# Altium schematic sheet Integrated Connectors.SchDoc
size Letter
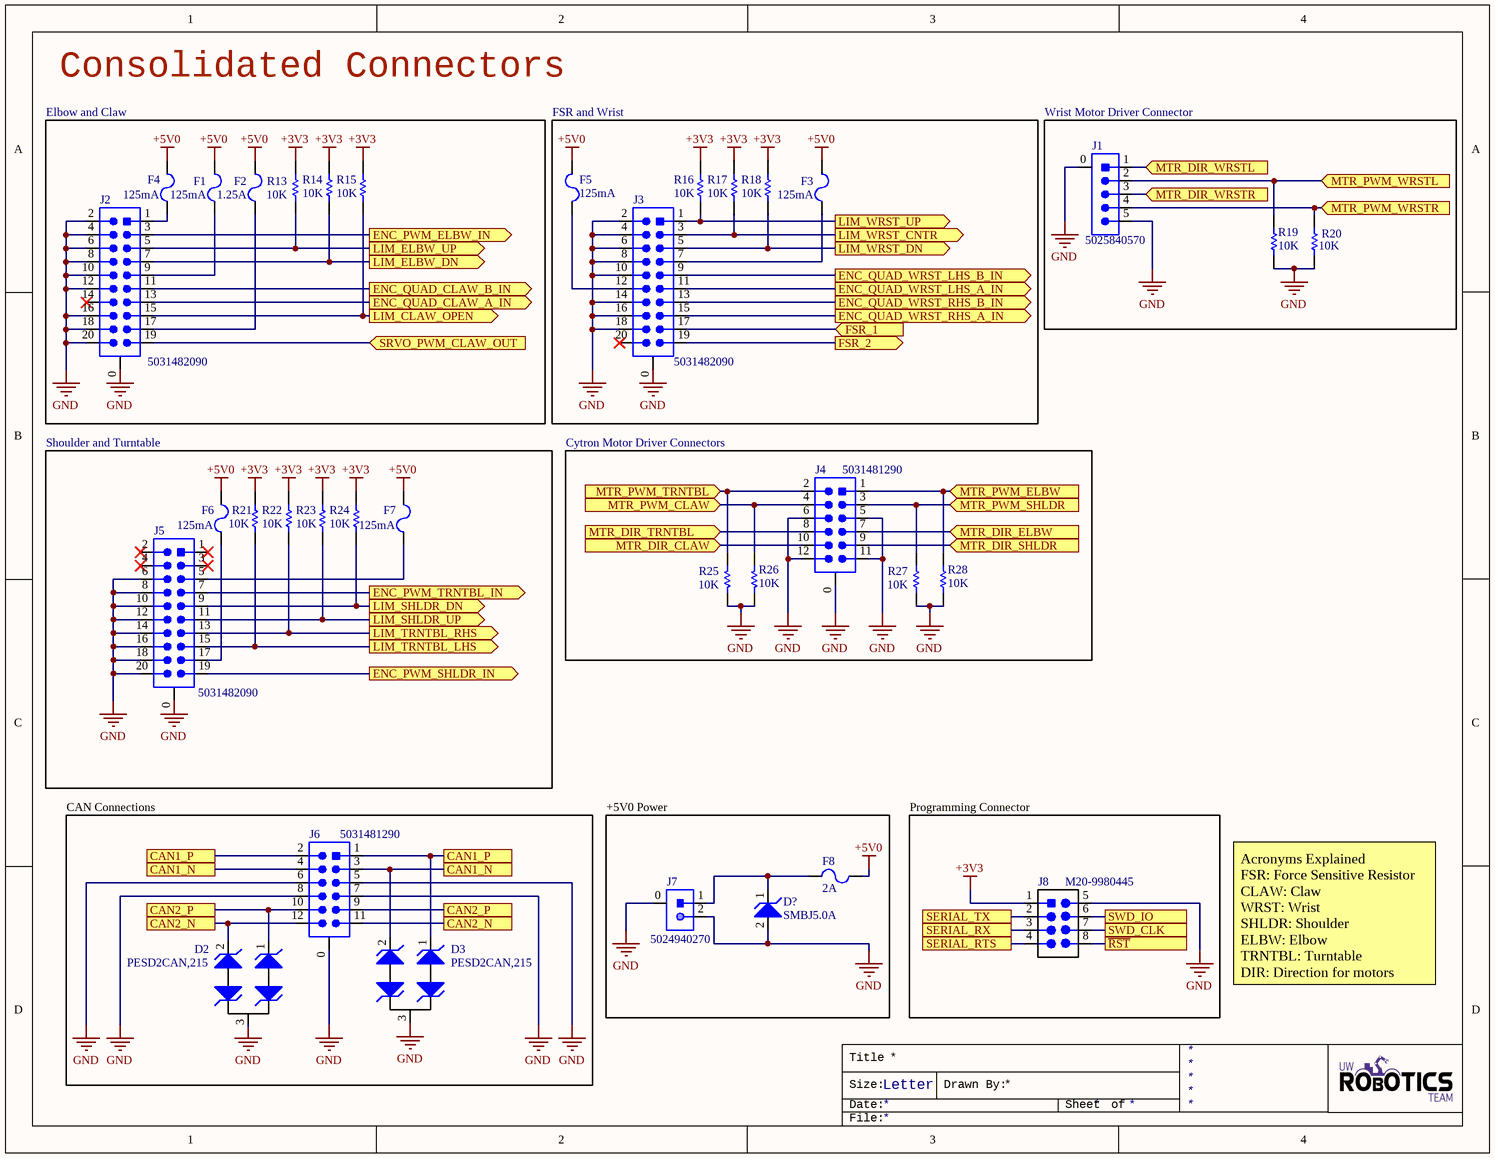
[diagram p0: Integrated Connectors.SchDoc]

## Parts
D2  Manufacturer Part Number 1: PESD2CAN,215  [TVS_DIODE_CAN]  (hidden comment: TVS_DIODE_CAN)
D3  Manufacturer Part Number 1: PESD2CAN,215  [TVS_DIODE_CAN]  (hidden comment: TVS_DIODE_CAN)
D?  Manufacturer Part Number 1: SMBJ5.0A  [TVS_DIODE_BIDIRECTIONAL]  (hidden comment: TVS_DIODE_UNIDIR_5V)
F1  Current Rating: 125mA  [FUSE_1206]  (hidden comment: FUSE_125mA_1206)
F2  Current Rating: 1.25A  [FUSE_1206]  (hidden comment: FUSE_1.25A_1206)
F3  Current Rating: 125mA  [FUSE_1206]  (hidden comment: FUSE_125mA_1206)
F4  Current Rating: 125mA  [FUSE_1206]  (hidden comment: FUSE_125mA_1206)
F5  Current Rating: 125mA  [FUSE_1206]  (hidden comment: FUSE_125mA_1206)
F6  Current Rating: 125mA  [FUSE_1206]  (hidden comment: FUSE_125mA_1206)
F7  Current Rating: 125mA  [FUSE_1206]  (hidden comment: FUSE_125mA_1206)
F8  Current Rating: 2A  [FUSE_1206]  (hidden comment: FUSE_2A_1206)
J1  Manufacturer Part Number 1: 5025840570  [MOLEX-5025840570]  (hidden comment: CON_5M_SM_VT)
J2  Manufacturer Part Number 1: 5031482090  [MOLEX-5031482090]  (hidden comment: CON_10x2M_SM_RA)
J3  Manufacturer Part Number 1: 5031482090  [MOLEX-5031482090]  (hidden comment: CON_10x2M_SM_RA)
J4  Manufacturer Part Number 1: 5031481290  [MOLEX-5031481290]  (hidden comment: CON_6x2M_SM_RA)
J5  Manufacturer Part Number 1: 5031482090  [MOLEX-5031482090]  (hidden comment: CON_10x2M_SM_RA)
J6  Manufacturer Part Number 1: 5031481290  [MOLEX-5031481290]  (hidden comment: CON_6x2M_SM_RA)
J7  Manufacturer Part Number 1: 5024940270  [MOLEX-5024940270]  (hidden comment: CON_2M_SM_RA)
J8  Manufacturer Part Number 1: M20-9980445  [HEADER_2X4]  (hidden comment: HEADER 4X2)
R13  value 10K  [RESC0603(1608)_N]  (hidden comment: RES_10K_0603)
R14  value 10K  [RESC0603(1608)_N]  (hidden comment: RES_10K_0603)
R15  value 10K  [RESC0603(1608)_N]  (hidden comment: RES_10K_0603)
R16  value 10K  [RESC0603(1608)_N]  (hidden comment: RES_10K_0603)
R17  value 10K  [RESC0603(1608)_N]  (hidden comment: RES_10K_0603)
R18  value 10K  [RESC0603(1608)_N]  (hidden comment: RES_10K_0603)
R19  value 10K  [RESC0603(1608)_N]  (hidden comment: RES_10K_0603)
R20  value 10K  [RESC0603(1608)_N]  (hidden comment: RES_10K_0603)
R21  value 10K  [RESC0603(1608)_N]  (hidden comment: RES_10K_0603)
R22  value 10K  [RESC0603(1608)_N]  (hidden comment: RES_10K_0603)
R23  value 10K  [RESC0603(1608)_N]  (hidden comment: RES_10K_0603)
R24  value 10K  [RESC0603(1608)_N]  (hidden comment: RES_10K_0603)
R25  value 10K  [RESC0603(1608)_N]  (hidden comment: RES_10K_0603)
R26  value 10K  [RESC0603(1608)_N]  (hidden comment: RES_10K_0603)
R27  value 10K  [RESC0603(1608)_N]  (hidden comment: RES_10K_0603)
R28  value 10K  [RESC0603(1608)_N]  (hidden comment: RES_10K_0603)

## Blocks framed on the sheet
Elbow and Claw: F1 F2 F4 J2 R13-R15
FSR and Wrist: F3 F5 J3 R16-R18
Wrist Motor Driver Connector: J1 R19 R20
Shoulder and Turntable: F6 F7 J5 R21-R24
Cytron Motor Driver Connectors: J4 R25-R28
CAN Connections: D2 D3 J6
+5V0 Power: D? F8 J7
Programming Connector: J8

## Ports
CAN1_N, CAN1_P, CAN2_N, CAN2_P, ENC_PWM_ELBW_IN (out), ENC_PWM_SHLDR_IN (out), ENC_PWM_TRNTBL_IN (out), ENC_QUAD_CLAW_A_IN (out), ENC_QUAD_CLAW_B_IN (out), ENC_QUAD_WRST_LHS_A_IN (out), ENC_QUAD_WRST_LHS_B_IN (out), ENC_QUAD_WRST_RHS_A_IN (out), ENC_QUAD_WRST_RHS_B_IN (out), FSR_1 (in), FSR_2 (out), LIM_CLAW_OPEN (out), LIM_ELBW_DN (out), LIM_ELBW_UP (out), LIM_SHLDR_DN (out), LIM_SHLDR_UP (out), LIM_TRNTBL_LHS (out), LIM_TRNTBL_RHS (out), LIM_WRST_CNTR (out), LIM_WRST_DN (out), LIM_WRST_UP (out), MTR_DIR_CLAW (in), MTR_DIR_ELBW (in), MTR_DIR_SHLDR (in), MTR_DIR_TRNTBL (in), MTR_DIR_WRSTL (in), MTR_DIR_WRSTR (in), MTR_PWM_CLAW (in), MTR_PWM_ELBW (in), MTR_PWM_SHLDR (in), MTR_PWM_TRNTBL (in), MTR_PWM_WRSTL (in), MTR_PWM_WRSTR (in), SERIAL_RTS, SERIAL_RX, SERIAL_TX, SRVO_PWM_CLAW_OUT (in), SWD_CLK, SWD_IO, ~{RST}

## Nets
+3V3: J8.1(VCC) R13.2 R14.2 R15.2 R16.2 R17.2 R18.2 R21.2 R22.2 R23.2 R24.2
+5V0: F1.2 F2.2 F3.2 F4.2 F5.2 F6.2 F7.2 F8.2
GND: D2.3 D3.3 D?.2 J1.0 J1.5 J2.0 J2.2 J2.4 J2.6 J2.8 J2.10 J2.12 J2.16 J2.18 J2.20 J3.0 J3.2 J3.4 J3.6 J3.8 J3.10 J3.14 J3.16 J3.18 J4.0 J4.5 J4.6 J4.11 J4.12 J5.0 J5.6 J5.8 J5.10 J5.12 J5.14 J5.16 J5.18 J5.20 J6.0 J6.5 J6.6 J6.7 J6.8 J7.0 J7.2 J8.5(GND) R19.1 R20.1 R25.1 R26.1 R27.1 R28.1
~{RST}: J8.8 ; port ~{RST}
CAN1_N: D3.2 J6.3 J6.4 ; port CAN1_N
CAN1_P: D3.1 J6.1 J6.2 ; port CAN1_P
CAN2_N: D2.2 J6.11 J6.12 ; port CAN2_N
CAN2_P: D2.1 J6.9 J6.10 ; port CAN2_P
ENC_PWM_ELBW_IN: J2.3 ; port ENC_PWM_ELBW_IN
ENC_PWM_SHLDR_IN: J5.19 ; port ENC_PWM_SHLDR_IN
ENC_PWM_TRNTBL_IN: J5.7 ; port ENC_PWM_TRNTBL_IN
ENC_QUAD_CLAW_A_IN: J2.13 ; port ENC_QUAD_CLAW_A_IN
ENC_QUAD_CLAW_B_IN: J2.11 ; port ENC_QUAD_CLAW_B_IN
ENC_QUAD_WRST_LHS_A_IN: J3.11 ; port ENC_QUAD_WRST_LHS_A_IN
ENC_QUAD_WRST_LHS_B_IN: J3.9 ; port ENC_QUAD_WRST_LHS_B_IN
ENC_QUAD_WRST_RHS_A_IN: J3.15 ; port ENC_QUAD_WRST_RHS_A_IN
ENC_QUAD_WRST_RHS_B_IN: J3.13 ; port ENC_QUAD_WRST_RHS_B_IN
FSR_1: J3.17 ; port FSR_1
FSR_2: J3.19 ; port FSR_2
LIM_CLAW_OPEN: J2.15 R15.1 ; port LIM_CLAW_OPEN
LIM_ELBW_DN: J2.7 R14.1 ; port LIM_ELBW_DN
LIM_ELBW_UP: J2.5 R13.1 ; port LIM_ELBW_UP
LIM_SHLDR_DN: J5.9 R24.1 ; port LIM_SHLDR_DN
LIM_SHLDR_UP: J5.11 R23.1 ; port LIM_SHLDR_UP
LIM_TRNTBL_LHS: J5.15 R21.1 ; port LIM_TRNTBL_LHS
LIM_TRNTBL_RHS: J5.13 R22.1 ; port LIM_TRNTBL_RHS
LIM_WRST_CNTR: J3.3 R17.1 ; port LIM_WRST_CNTR
LIM_WRST_DN: J3.5 R18.1 ; port LIM_WRST_DN
LIM_WRST_UP: J3.1 R16.1 ; port LIM_WRST_UP
MTR_DIR_CLAW: J4.10 ; port MTR_DIR_CLAW
MTR_DIR_ELBW: J4.7 ; port MTR_DIR_ELBW
MTR_DIR_SHLDR: J4.9 ; port MTR_DIR_SHLDR
MTR_DIR_TRNTBL: J4.8 ; port MTR_DIR_TRNTBL
MTR_DIR_WRSTL: J1.1 ; port MTR_DIR_WRSTL
MTR_DIR_WRSTR: J1.3 ; port MTR_DIR_WRSTR
MTR_PWM_CLAW: J4.4 R26.2 ; port MTR_PWM_CLAW
MTR_PWM_ELBW: J4.1 R28.2 ; port MTR_PWM_ELBW
MTR_PWM_SHLDR: J4.3 R27.2 ; port MTR_PWM_SHLDR
MTR_PWM_TRNTBL: J4.2 R25.2 ; port MTR_PWM_TRNTBL
MTR_PWM_WRSTL: J1.2 R19.2 ; port MTR_PWM_WRSTL
MTR_PWM_WRSTR: J1.4 R20.2 ; port MTR_PWM_WRSTR
SERIAL_RTS: J8.4 ; port SERIAL_RTS
SERIAL_RX: J8.3 ; port SERIAL_RX
SERIAL_TX: J8.2 ; port SERIAL_TX
SRVO_PWM_CLAW_OUT: J2.19 ; port SRVO_PWM_CLAW_OUT
SWD_CLK: J8.7 ; port SWD_CLK
SWD_IO: J8.6 ; port SWD_IO
NetD?_1: D?.1 F8.1 J7.1
NetF1_1: F1.1 J2.9
NetF2_1: F2.1 J2.17
NetF3_1: F3.1 J3.7
NetF4_1: F4.1 J2.1
NetF5_1: F5.1 J3.12
NetF6_1: F6.1 J5.17
NetF7_1: F7.1 J5.5

Not connected (* = marked no-connect by the designer): J2 14*; J3 20*; J5 1* 2* 3* 4*

## Notes on the sheet
- Consolidated Connectors
- Acronyms Explained
  FSR: Force Sensitive Resistor
  CLAW: Claw
  WRST: Wrist
  SHLDR: Shoulder
  ELBW: Elbow
  TRNTBL: Turntable
  DIR: Direction for motors
- Title
- Size:
- Date:
- Letter
- Drawn By:
- Sheet
- of
- File:

## Library data of the parts
D2 D3 = TVS_DIODE_CAN: TVS DIODE 24V 41V SOT323-3; Manufacturer 1: Nexperia USA Inc.; Package: SC-70, SOT-323; ComponentLink1Description: Datasheet; ComponentLink1URL: https://assets.nexperia.com/documents/data-sheet/PESD1CAN-U.pdf; Supplier Part Number 1: 1727-3891-1-ND; Supplier 1: Digi-Key; Mount: Surface Mount
D? = TVS_DIODE_UNIDIR_5V: TVS DIODE 5V 9.2V DO214AA; Manufacturer 1: Littelfuse; Max Power Dissipation: 600W; Polarity: Unidirectional; Number of Elements: 1; Leakage Current: 800uA; Reverse Breakdown Voltage: 6.4V; Max Surge Current: 65.3A; Max Breakdown Voltage: 7V; Test Current: 10mA; Element Configuration: Single; Power Line Protection: No; Current: 68A; ESD Protection: Yes; ComponentLink1Description: Datasheet; ComponentLink1URL: https://www.littelfuse.com/~/media/electronics/datasheets/tvs_diodes/littelfuse_tvs_diode_smbj_datasheet.pdf.pdf; Supplier 1: Digi-Key; Stock 1: 14825; Pricing 1: 1=0.41000, 10=0.30500, 25=0.27520, 100=0.14500, 250=0.14352, 500=0.12850, 1000=0.10000 (USD); RoHS: Yes; Mount: Surface Mount; Case/Package: SMB; Number of Pins: 2; Min Operating Temperature: -55°C; Max Operating Temperature: 150°C; Packaging: Tape and Reel; Package Quantity: 3000; Power Dissipation: 600W; Direction: Unidirectional; Reverse Standoff Voltage: 5V; Min Breakdown Voltage: 6.4V; Clamping Voltage: 9.2V; Peak Pulse Power: 600W; Breakdown Voltage: 6.4V; Termination: SMD/SMT; Peak Pulse Current: 65.3A; Number of Channels: 1; Max Reverse Leakage Current: 800uA; Operating Supply Voltage: 5V; Number of Unidirectional Channels: 1; Composition: Zener; Voltage Rating (DC): 5V; Voltage: 5V; Length: 0.179inch; Height: 0.096inch; Width: 0.155inch; Radiation Hardening: No; REACH SVHC: Unknown; Lead Free: Lead Free; ComponentLink2URL: https://datasheet.ciiva.com/25624/0900766b810f4eeb-25624712.pdf?src-supplier=RSComponents; ComponentLink2Description: https://datasheet.ciiva.com/25624/0900766b810f4eeb-25624712.pdf?src-supplier=RSComponents; ComponentLink3URL: https://datasheet.ciiva.com/34302/1546929-34302459.pdf?src-supplier=Jameco; ComponentLink3Description: https://datasheet.ciiva.com/34302/1546929-34302459.pdf?src-supplier=Jameco; ComponentLink4URL: https://datasheet.ciiva.com/46381/1677318-46381958.pdf?src-supplier=Element14; ComponentLink4Description: https://datasheet.ciiva.com/46381/1677318-46381958.pdf?src-supplier=Element14; ComponentLink5URL: https://datasheet.ciiva.com/331/littelfuse-tvs-diode-smbj-datasheet-pdf-331131.pdf?src-supplier=Digi-Key; ComponentLink5Description: https://datasheet.ciiva.com/331/littelfuse-tvs-diode-smbj-datasheet-pdf-331131.pdf?src-supplier=Digi-Key; ComponentLink6URL: https://datasheet.ciiva.com/331/littelfuse-tvs-diode-smbj-datasheet-pdf-331132.pdf?src-supplier=Digi-Key; ComponentLink6Description: https://datasheet.ciiva.com/331/littelfuse-tvs-diode-smbj-datasheet-pdf-331132.pdf?src-supplier=Digi-Key; ComponentLink7URL: https://datasheet.ciiva.com/331/littelfuse-tvs-diode-smbj-datasheet-pdf-331133.pdf?src-supplier=Digi-Key; ComponentLink7Description: https://datasheet.ciiva.com/331/littelfuse-tvs-diode-smbj-datasheet-pdf-331133.pdf?src-supplier=Digi-Key; Supplier Part Number 1: SMBJ5.0ALFCT-ND
F1 F3-F7 = FUSE_125mA_1206: FUSE SMD 125mA 125V; Manufacturer 1: Littelfuse; Manufacturer Part Number 1: 0466.125NRHF; DC Cold Resistance: 4R; Fuse Type: Board Mount (Cartridge Style Excluded); Power Dissipation: 69.1mW; Approvals: UL,CSA; ComponentLink1URL: https://datasheet.ciiva.com/303/littelfuse-fuse-466-303205.pdf?src-supplier=Digi-Key; ComponentLink1Description: https://datasheet.ciiva.com/303/littelfuse-fuse-466-303205.pdf?src-supplier=Digi-Key; Voltage Rating (AC): 125V; Voltage Rating (DC): 125V; Supplier 1: Digi-Key; Supplier Part Number 1: F6016CT-ND; Mount: Surface Mount; Stock 1: 10036; Pricing 1: 1=0.84000, 5=0.81200, 10=0.78700, 50=0.66180, 100=0.54930, 250=0.49940, 500=0.42450, 1000=0.37455 (USD); RoHS: Yes; Case/Package: 1206; Case Code (Metric): 3216; Case Code (Imperial): 1206; Housing Material: Ceramic; Min Operating Temperature: -55°C; Max Operating Temperature: 90°C; Packaging: Tape and Reel; Working Voltage: 125V; Package Quantity: 5000; Length: 3.18mm; Height: 0.023inch; Depth: 1.52mm; Width: 0.06inch; Lead Free: Lead Free
F2 = FUSE_1.25A_1206: FUSE SMD 1.25A 63V; Manufacturer 1: Littelfuse; Manufacturer Part Number 1: 04661.25NRHF; DC Cold Resistance: 59mR; Fuse Type: Board Mount (Cartridge Style Excluded); Approvals: UL,CSA; ComponentLink1URL: https://www.littelfuse.com/~/media/electronics/datasheets/fuses/littelfuse_fuse_466_datasheet.pdf.pdf?src-supplier=Digi-Key; ComponentLink1Description: https://www.littelfuse.com/~/media/electronics/datasheets/fuses/littelfuse_fuse_466_datasheet.pdf.pdf?src-supplier=Digi-Key; Voltage Rating (AC): 63V; Voltage Rating (DC): 63V; Supplier 1: Digi-Key; Supplier Part Number 1: F11418CT-ND; Mount: Surface Mount; Stock 1: 5020; Pricing 1: 1=0.84000, 5=0.81200, 10=0.78700, 50=0.66180, 100=0.54930, 250=0.49940, 500=0.42450, 1000=0.37455 (USD); RoHS: No; Case/Package: 1206; Case Code (Metric): 3216; Case Code (Imperial): 1206; Min Operating Temperature: -55°C; Max Operating Temperature: 90°C; Packaging: Tape and Reel
F8 = FUSE_2A_1206: FUSE SMD 2A 63V; Manufacturer Part Number 1: 0466002.NRHF; Manufacturer 1: Littelfuse; Fuse Type: Board Mount (Cartridge Style Excluded); DC Cold Resistance: 31mR; Power Dissipation: 157.5mW; Approvals: UL,CSA; ComponentLink1URL: https://datasheet.ciiva.com/7444/littelfuse-fuse-466-7444359.pdf?src-supplier=Digi-Key; ComponentLink1Description: https://datasheet.ciiva.com/7444/littelfuse-fuse-466-7444359.pdf?src-supplier=Digi-Key; ComponentLink2URL: https://datasheet.ciiva.com/7444/littelfuse-fuse-466-7444363.pdf?src-supplier=Digi-Key; ComponentLink2Description: https://datasheet.ciiva.com/7444/littelfuse-fuse-466-7444363.pdf?src-supplier=Digi-Key; ComponentLink3URL: https://datasheet.ciiva.com/7444/littelfuse-fuse-466-7444350.pdf?src-supplier=Digi-Key; ComponentLink3Description: https://datasheet.ciiva.com/7444/littelfuse-fuse-466-7444350.pdf?src-supplier=Digi-Key; Mount: Surface Mount; Voltage Rating (AC): 63V; Voltage Rating (DC): 63V; Supplier 1: Digi-Key; Supplier Part Number 1: F5696CT-ND; Stock 1: 8989; Pricing 1: 1=0.84000, 5=0.81200, 10=0.78700, 50=0.66180, 100=0.54930, 250=0.49940, 500=0.42450, 1000=0.37455 (USD); RoHS: Yes; Case/Package: 1206; Case Code (Imperial): 1206; Case Code (Metric): 3216; Housing Material: Ceramic; Min Operating Temperature: -55°C; Max Operating Temperature: 90°C; Package Quantity: 5000; Packaging: Tape and Reel; Current: 2A; Length: 3.18mm; Height: 0.023inch; Width: 0.06inch; Depth: 1.52mm
J1 = CON_5M_SM_VT: CONN HEADER SMD VERTICAL 1.5MM PITCH; Manufacturer 1: Molex; Connector Type: Receptacle,Center Strip Contact; Number of Positions: 5; Gender: Female; Current Rating: 2A; Voltage Rating: 100V; Glow Wire Compliant: Non-compliant; Supplier 1: Digi-Key; Stock 1: 2875; Pricing 1: 1=0.66000, 10=0.61400, 100=0.47110 (USD); RoHS: Yes; Mount: Surface Mount; Housing Material: Resin; Housing Color: Beige; Contact Plating: Tin; Color: Beige; Contact Material: Copper Alloy; Min Operating Temperature: -25°C; Max Operating Temperature: 85°C; Termination: Solder; Number of Contacts: 5; Orientation: Vertical; Number of Circuits: 5; Number of Rows: 1; Package Quantity: 900; Fastening Type: Latch; Packaging: Tape and Reel; Contact Gender: Female; Length: 11.8mm; Pitch: 1.5mm; Depth: 6.35mm; Radiation Hardening: No; REACH SVHC: No SVHC; ComponentLink1URL: https://datasheet.ciiva.com/756/5025840370-sd-756789.pdf?src-supplier=Digi-Key; ComponentLink1Description: https://datasheet.ciiva.com/756/5025840370-sd-756789.pdf?src-supplier=Digi-Key; ComponentLink2URL: https://datasheet.ciiva.com/30117/81825025840570-pcb-receptacles-30117024.pdf?src-supplier=Onlinecomponents.com; ComponentLink2Description: https://datasheet.ciiva.com/30117/81825025840570-pcb-receptacles-30117024.pdf?src-supplier=Onlinecomponents.com; ComponentLink3URL: https://datasheet.ciiva.com/10084/5025840570-pcb-receptacles-10084838.pdf?src-supplier=Avnet; ComponentLink3Description: https://datasheet.ciiva.com/10084/5025840570-pcb-receptacles-10084838.pdf?src-supplier=Avnet; ComponentLink4URL: https://datasheet.ciiva.com/13669/5025840570-pcb-receptacles-179570-13669898.pdf?src-supplier=Mouser; ComponentLink4Description: https://datasheet.ciiva.com/13669/5025840570-pcb-receptacles-179570-13669898.pdf?src-supplier=Mouser; Supplier Part Number 1: WM14463CT-ND
J2 J3 J5 = CON_10x2M_SM_RA: CONN HEADER SMD RIGHT ANGLE 1.5MM PITCH; Manufacturer 1: Molex; Voltage Rating: 100V; Current Rating: 1A; Connector Type: Receptacle,Forked,Center Strip Contact; Number of Positions: 20; Gender: Receptacle; Glow Wire Compliant: Non-compliant; Supplier 1: Digi-Key; Stock 1: 1742; Pricing 1: 1=2.37000, 10=2.14700, 100=1.83990 (USD); RoHS: Yes; Mount: Surface Mount,Through Hole; Housing Material: Resin; Color: Beige; Housing Color: Beige; Contact Material: Copper Alloy,Copper,Tin; Contact Plating: Tin; Min Operating Temperature: -25°C; Max Operating Temperature: 85°C; Number of Rows: 2; Packaging: Tape and Reel; Package Quantity: 550; Fastening Type: Latch; Orientation: Right Angle; Termination: Solder; Number of Contacts: 20; Contact Gender: Female; Number of Circuits: 20; Length: 19.3mm; Pitch: 1.5mm; Row Spacing: 1.5mm; Depth: 9.55mm; Radiation Hardening: No; REACH SVHC: No SVHC; ComponentLink1URL: https://datasheet.ciiva.com/6787/5031482090-sd-6787557.pdf?src-supplier=Digi-Key; ComponentLink1Description: https://datasheet.ciiva.com/6787/5031482090-sd-6787557.pdf?src-supplier=Digi-Key; ComponentLink2URL: https://datasheet.ciiva.com/10076/5031482090-pcb-receptacles-10076785.pdf?src-supplier=Avnet; ComponentLink2Description: https://datasheet.ciiva.com/10076/5031482090-pcb-receptacles-10076785.pdf?src-supplier=Avnet; ComponentLink3URL: https://datasheet.ciiva.com/5153/5031482090-pcb-receptacles-179510-5153198.pdf?src-supplier=Mouser; ComponentLink3Description: https://datasheet.ciiva.com/5153/5031482090-pcb-receptacles-179510-5153198.pdf?src-supplier=Mouser; ComponentLink4URL: https://datasheet.ciiva.com/30082/72715031482090-pcb-receptacles-30082526.pdf?src-supplier=Onlinecomponents.com; ComponentLink4Description: https://datasheet.ciiva.com/30082/72715031482090-pcb-receptacles-30082526.pdf?src-supplier=Onlinecomponents.com; ComponentLink5URL: https://datasheet.ciiva.com/6787/5031482090-sd-6787542.pdf?src-supplier=Digi-Key; ComponentLink5Description: https://datasheet.ciiva.com/6787/5031482090-sd-6787542.pdf?src-supplier=Digi-Key; ComponentLink6URL: https://datasheet.ciiva.com/6787/5031482090-sd-6787548.pdf?src-supplier=Digi-Key; ComponentLink6Description: https://datasheet.ciiva.com/6787/5031482090-sd-6787548.pdf?src-supplier=Digi-Key; Supplier Part Number 1: WM9451CT-ND
J4 J6 = CON_6x2M_SM_RA: CONN HEADER SMD RIGHT ANGLE 1.5MM PITCH; Manufacturer 1: Molex; Number of Circuits: 12; Voltage Rating: 100V; Current Rating: 1A; Connector Type: Receptacle,Center Strip Contact; Gender: Receptacle; Glow Wire Compliant: Non-compliant; Supplier 1: Digi-Key; Stock 1: 276; Pricing 1: 1=1.86000, 10=1.68800, 100=1.44720 (USD); RoHS: Yes; Mount: Surface Mount,Through Hole; Contact Plating: Tin; Contact Material: Copper Alloy,Copper,Tin; Housing Color: Beige; Color: Beige; Housing Material: Resin; Min Operating Temperature: -25°C; Max Operating Temperature: 85°C; Packaging: Tape and Reel; Orientation: Right Angle; Number of Rows: 2; Package Quantity: 550; Fastening Type: Latch; Contact Gender: Female; Number of Positions: 12; Termination: Solder; Number of Contacts: 12; Length: 13.3mm; Pitch: 1.5mm; Depth: 9.55mm; Radiation Hardening: No; REACH SVHC: Unknown; ComponentLink1URL: https://datasheet.ciiva.com/756/5031481090-sd-756828.pdf?src-supplier=Digi-Key; ComponentLink1Description: https://datasheet.ciiva.com/756/5031481090-sd-756828.pdf?src-supplier=Digi-Key; ComponentLink2URL: https://datasheet.ciiva.com/10083/5031481290-pcb-receptacles-10083012.pdf?src-supplier=Avnet; ComponentLink2Description: https://datasheet.ciiva.com/10083/5031481290-pcb-receptacles-10083012.pdf?src-supplier=Avnet; ComponentLink3URL: https://datasheet.ciiva.com/30261/68305031481290-pcb-receptacles-30261716.pdf?src-supplier=Onlinecomponents.com; ComponentLink3Description: https://datasheet.ciiva.com/30261/68305031481290-pcb-receptacles-30261716.pdf?src-supplier=Onlinecomponents.com; ComponentLink4URL: https://datasheet.ciiva.com/5162/5031481290-pcb-receptacles-179578-5162271.pdf?src-supplier=Mouser; ComponentLink4Description: https://datasheet.ciiva.com/5162/5031481290-pcb-receptacles-179578-5162271.pdf?src-supplier=Mouser; ComponentLink5URL: https://datasheet.ciiva.com/14155/503148-eng-tds-14155950.pdf?src-supplier=Distrelec; ComponentLink5Description: https://datasheet.ciiva.com/14155/503148-eng-tds-14155950.pdf?src-supplier=Distrelec; Supplier Part Number 1: WM14476CT-ND
J7 = CON_2M_SM_RA: CONN HEADER SMD RIGHT ANGLE 2MM PITCH; Manufacturer 1: Molex; Connector Type: Receptacle,Forked; Number of Positions: 2; Supplier 1: Digi-Key; Stock 1: 3397; Pricing 1: 1=0.53000, 10=0.49400, 25=0.44440, 50=0.39500, 100=0.37850, 250=0.34556 (USD); RoHS: No; Mount: Surface Mount; Contact Plating: Tin; Insulation Color: Natural; Insulation Material: Resin; Min Operating Temperature: -40°C; Max Operating Temperature: 105°C; Fastening Type: Latch; Packaging: Tape and Reel; Number of Rows: 1; Termination: Solder; Flammability Rating: UL94 V-0; ComponentLink1URL: https://www.molex.com/pdm_docs/as/AS-502439-002-001.pdf?src-supplier=Digi-Key; ComponentLink1Description: https://www.molex.com/pdm_docs/as/AS-502439-002-001.pdf?src-supplier=Digi-Key; Supplier Part Number 1: WM15810CT-ND
J8 = HEADER 4X2: CONN HEADER VERT 8POS 2.54MM; Manufacturer 1: Harwin Inc.; Supplier Part Number 1: 952-2122-ND; Supplier 1: Digi-Key; Mount: Through Hole
R13-R28 = RES_10K_0603: RES SMD 10K OHM 5% 1/10W 0603; Manufacturer: Yageo; MPN: RC0603JR-0710KL; Package: 0603 (1608 Metric); Dimensions: 0.063" L x 0.031" W (1.60mm x 0.80mm); Tolerance: 5%; Supplier Part Number 1: 311-10KGRCT-ND; Supplier 1: Digi-Key